# EasyEDA schematic SCH_openELECTRO - ArduinoUNO - OVEN_2022-06-18.json
TITLE: openELECTRO - ArduinoUNO SHIELD - oven; REV: 0.90; Date: 2022-06-16; Sheet: 1/1; Drawn By: carlymx; Company: carlymx@gmail.com
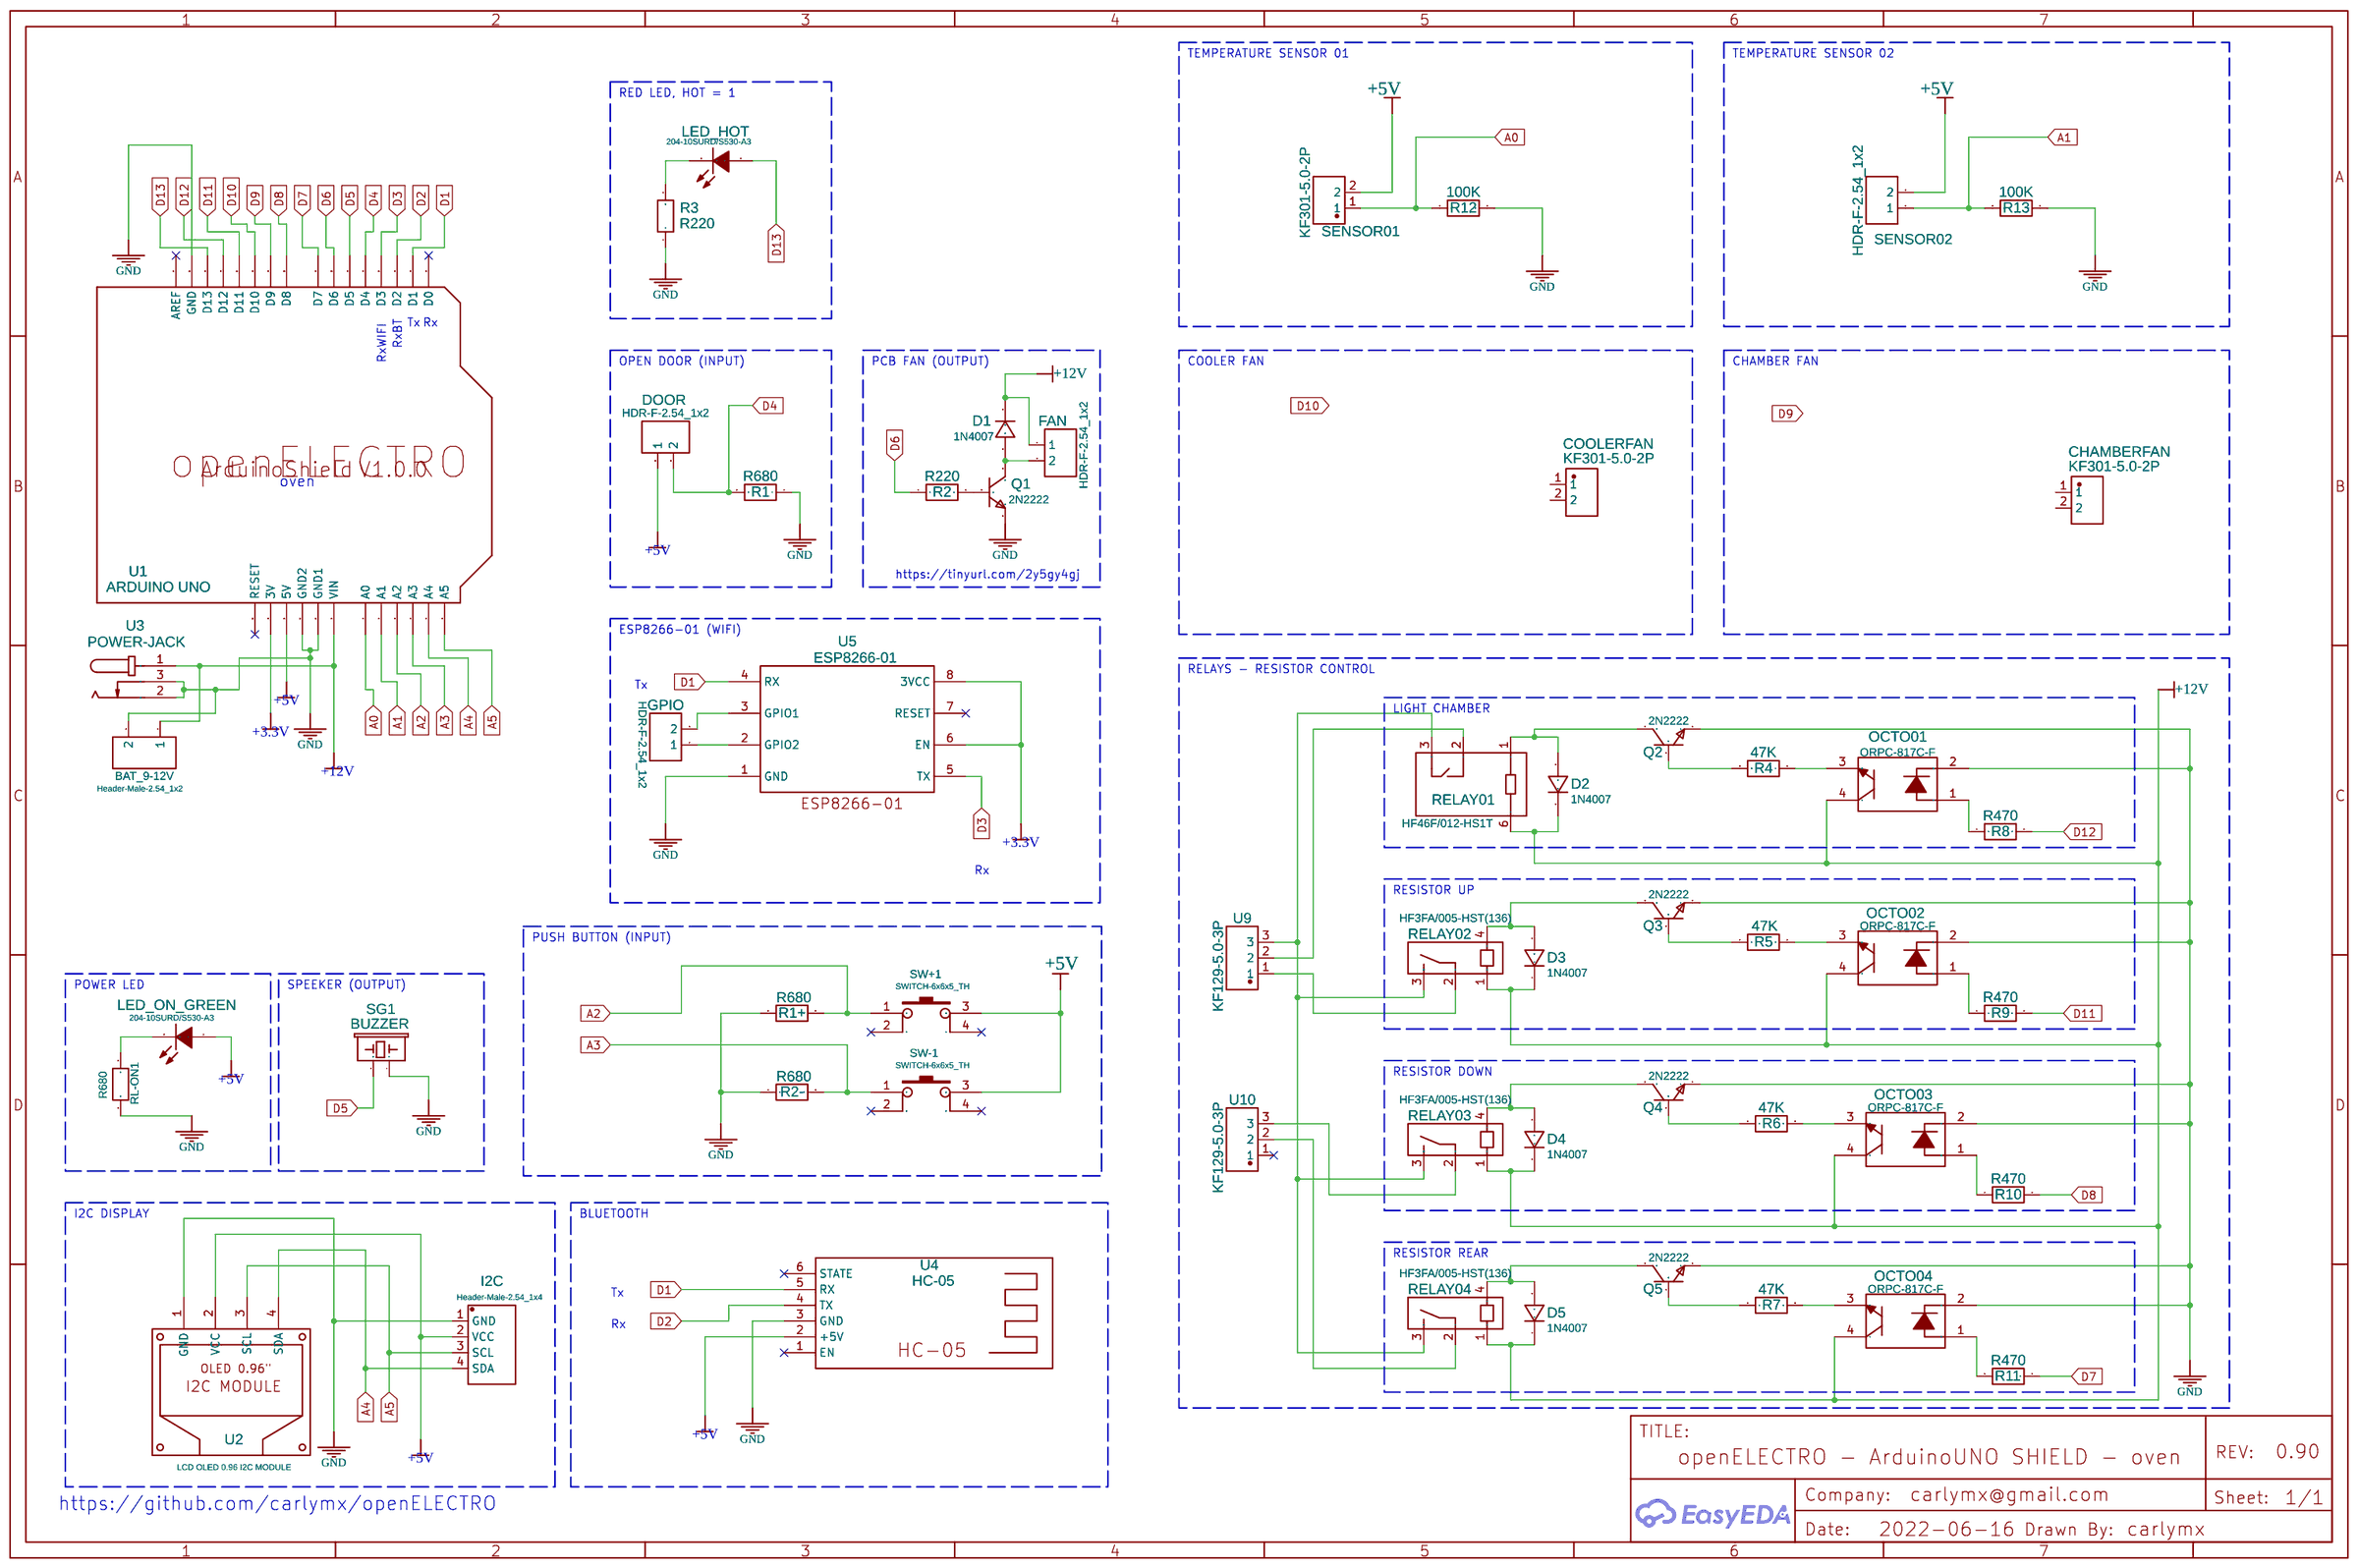
[diagram p0: schematic sheet]

## Parts
BAT_9-12V  Header-Male-2.54_1x2  [HDR-2X1/2.54]
CHAMBERFAN  KF301-5.0-2P  [CONN-TH_P5.00_KF301-5.0-2P]
COOLERFAN  KF301-5.0-2P  [CONN-TH_P5.00_KF301-5.0-2P]
D1  1N4007  [DO-41_BD2.4-L4.7-P8.70-D0.9-RD]
D2  1N4007  [DO-41_BD2.4-L4.7-P8.70-D0.9-RD]
D3  1N4007  [DO-41_BD2.4-L4.7-P8.70-D0.9-RD]
D4  1N4007  [DO-41_BD2.4-L4.7-P8.70-D0.9-RD]
D5  1N4007  [DO-41_BD2.4-L4.7-P8.70-D0.9-RD]
DOOR  HDR-F-2.54_1x2  [HDR-F-2.54_1X2]
FAN  HDR-F-2.54_1x2  [HDR-F-2.54_1X2]
GPIO  HDR-F-2.54_1x2  [HDR-F-2.54_1X2]
I2C  Header-Male-2.54_1x4  [DIP-1X4P-2.54MM-M]
LED_HOT  204-10SURD/S530-A3  [LED-3MM/2.54]
LED_ON_GREEN  204-10SURD/S530-A3  [LED-3MM/2.54]
OCTO01  ORPC-817C-F  [DIP-4_L4.6-W6.5-P2.54-LS7.6-BR]
OCTO02  ORPC-817C-F  [DIP-4_L4.6-W6.5-P2.54-LS7.6-BR]
OCTO03  ORPC-817C-F  [DIP-4_L4.6-W6.5-P2.54-LS7.6-BR]
OCTO04  ORPC-817C-F  [DIP-4_L4.6-W6.5-P2.54-LS7.6-BR]
Q1  2N2222  [TO-92-3_L4.9-W3.7-P1.27-L]
Q2  2N2222  [TO-92-3_L4.9-W3.7-P1.27-L]
Q3  2N2222  [TO-92-3_L4.9-W3.7-P1.27-L]
Q4  2N2222  [TO-92-3_L4.9-W3.7-P1.27-L]
Q5  2N2222  [TO-92-3_L4.9-W3.7-P1.27-L]
R1  R680  [R0603]
R1+  R680  [AXIAL-0.3]
R2  R220  [R0603]
R2-  R680  [AXIAL-0.3]
R3  R220  [R0603]
R4  47K  [R0603]
R5  47K  [R0603]
R6  47K  [R0603]
R7  47K  [R0603]
R8  R470  [R0603]
R9  R470  [R0603]
R10  R470  [R0603]
R11  R470  [R0603]
R12  100K  [R0603]
R13  100K  [R0603]
RELAY01  HF46F/012-HS1T  [RELAYS-TH_HF46F-XX-HS1-XXX]
RELAY02  HF3FA/005-HST(136)  [RELAY-TH_HF3FA-005-HST-136]
RELAY03  HF3FA/005-HST(136)  [RELAY-TH_HF3FA-005-HST-136]
RELAY04  HF3FA/005-HST(136)  [RELAY-TH_HF3FA-005-HST-136]
RL-ON1  R680  [AXIAL-0.3]
SENSOR01  KF301-5.0-2P  [CONN-TH_P5.00_KF301-5.0-2P]
SENSOR02  HDR-F-2.54_1x2  [HDR-F-2.54_1X2]
SG1  BUZZER  [BUZZER-12MM-NS-KIT]
SW+1  SWITCH-6x6x5_TH  [SWITCH-6X6X5_TH PAGE]
SW-1  SWITCH-6x6x5_TH  [SWITCH-6X6X5_TH PAGE]
U1  ARDUINO UNO  [SIMON.INO SHIELD]
U2  LCD OLED 0.96 I2C MODULE  [LCD OLED 0.96 I2C PCB MODULE]
U3  POWER-JACK  [DC-IN-TH_POWER-JACK]
U4  HC-05  [HC-05]
U5  ESP8266-01  [ESP8266-01]
U9  KF129-5.0-3P  [CONN-TH_3P-P5.00_KF129-5.0-3P]
U10  KF129-5.0-3P  [CONN-TH_3P-P5.00_KF129-5.0-3P]

## Library data of the parts
BAT_9-12V = -: Supplier: LCSC; Manufacturer: TE Connectivity; Manufacturer Part: 826629-2; image: //image.lceda.cn/szlcsc/C86471.jpg; Supplier Part: C86471
CHAMBERFAN COOLERFAN SENSOR01 = KF301-5.0-2P: Supplier: LCSC; Supplier Part: C474881; Manufacturer: Cixi Kefa Elec; Contributor: LCSC; JLCPCB Part Class: Extended Part
D1-D5 = 1N4007: Supplier: LCSC; Manufacturer: SEMTECH; Supplier Part: C106903; Contributor: LCEDA_Lib
DOOR FAN GPIO SENSOR02 = HDR-F-2.54_1x2: Supplier Part: C49661; Supplier: LCSC; Contributor: LCEDA_Lib
I2C = -: Supplier: LCSC; Manufacturer: Ckmtw; Manufacturer Part: 210S-1*4P L=11.6MMGold-plated black; Contributor: LCSC; Supplier Part: C124378
LED_HOT LED_ON_GREEN = -: Supplier: LCSC; Manufacturer: EVERLIGHT; Supplier Part: C99772
OCTO01 OCTO02 OCTO03 OCTO04 = ORPC-817C-F: Supplier: LCSC; Supplier Part: C2842770; Manufacturer: Orient(奥伦德); Contributor: LCSC
Q1-Q5 = 2N2222: Supplier: LCSC; Manufacturer: SEMTECH; Contributor: LCSC; Supplier Part: C118536; JLCPCB Part Class: Extended Part
R1-R13 = R_0603_EU: Contributor: LCEDA_Lib
R1+ R2- RL-ON1 = Res_AXIAL-0.3(1/8W)_EU
RELAY01 = HF46F/012-HS1T: Supplier: LCSC; Supplier Part: C2976852; Manufacturer: HF(宏发); link: https://atta.szlcsc.com/upload/public/pdf/source/20220224/4471DAC9234B5C2A1A34433FC9A7C12C.pdf; Contributor: LCSC
RELAY02 RELAY03 RELAY04 = HF3FA/005-HST(136): Supplier: LCSC; Supplier Part: C712707; Manufacturer: HF(Xiamen Hongfa Electroacoustic); Contributor: LCSC; JLCPCB Part Class: Extended Part
SG1 = -: Contributor: SparkFun
SW+1 SW-1 = -: Supplier Part: C69330; Supplier: LCSC; Manufacturer: LCSC
U1 = -: Arduino DiecimilaDuemilanove; Contributor: Adafruit
U2 = -: Manufacturer Part: Control Chip SSD1306; link: http://www.inno-maker.com/wp-content/uploads/2019/03/096-OLED-Module-User-Manual-v1000-en.pdf; Contributor: carlymx
U3 = POWER-JACK: Supplier: LCSC; Supplier Part: C9900001795; Manufacturer: null; JLCPCB Part Class: Extended Part; Contributor: LCSC
U4 = -: Supplier: MR; Contributor: SRY TIS
U5 = ESP8266-01: Supplier: LCSC; Contributor: Dan3D_Concept
U9 U10 = KF129-5.0-3P: Supplier: LCSC; Supplier Part: C475091; Manufacturer: Cixi Kefa Elec; Contributor: LCSC; JLCPCB Part Class: Extended Part

## Nets
+3.3V: U1.3V U5.6(EN) U5.8(3VCC)
+5V: DOOR.1 I2C.2(VCC) LED_ON_GREEN.1(A) SENSOR01.2 SENSOR02.2 SW+1.3 SW-1.3 U1.5V U2.2(VCC) U4.2(+5V)
+12V: BAT_9-12V.1 D1.1 D2.1 D3.1 D4.1 D5.1 FAN.1 OCTO01.4 OCTO02.4 OCTO03.4 OCTO04.4 RELAY01.6 RELAY02.1 RELAY03.1 RELAY04.1 U1.VIN U3.1
GND: BAT_9-12V.2 I2C.1(GND) OCTO01.2 OCTO02.2 OCTO03.2 OCTO04.2 Q1.1(E) Q2.1(E) Q3.1(E) Q4.1(E) Q5.1(E) R1.1 R1+.1 R2-.1 R3.1 R12.2 R13.2 RL-ON1.1 SG1.-(2) U1.GND U1.GND1 U1.GND2 U2.1(GND) U3.2 U3.3 U4.3(GND) U5.1(GND)
A0: R12.1 SENSOR01.1 U1.A0
A1: R13.1 SENSOR02.1 U1.A1
A2: R1+.2 SW+1.1 U1.A2
A3: R2-.2 SW-1.1 U1.A3
A4: I2C.4(SDA) U1.A4 U2.4(SDA)
A5: I2C.3(SCL) U1.A5 U2.3(SCL)
D1: U1.D1 U4.5(RX) U5.4(RX)
D2: U1.D2 U4.4(TX)
D3: U1.D3 U5.5(TX)
D4: DOOR.2 R1.2 U1.D4
D5: SG1.+(1) U1.D5
D6: R2.1 U1.D6
D7: R11.2 U1.D7
D8: R10.2 U1.D8
D9: U1.D9
D10: U1.D10
D11: R9.2 U1.D11
D12: R8.2 U1.D12
D13: LED_HOT.1(A) U1.D13
Net-(D1-2): D1.2 FAN.2 Q1.3(C)
Net-(D2-2): D2.2 Q2.3(C) RELAY01.1
Net-(D3-2): D3.2 Q3.3(C) RELAY02.4
Net-(D4-2): D4.2 Q4.3(C) RELAY03.4
Net-(D5-2): D5.2 Q5.3(C) RELAY04.4
Net-(GPIO-1): GPIO.1 U5.2(GPIO2)
Net-(GPIO-2): GPIO.2 U5.3(GPIO1)
Net-(LED_HOT-2): LED_HOT.2(K) R3.2
Net-(LED_ON_GREEN-2): LED_ON_GREEN.2(K) RL-ON1.2
Net-(OCTO01-1): OCTO01.1 R8.1
Net-(OCTO01-3): OCTO01.3 R4.1
Net-(OCTO02-1): OCTO02.1 R9.1
Net-(OCTO02-3): OCTO02.3 R5.2
Net-(OCTO03-1): OCTO03.1 R10.1
Net-(OCTO03-3): OCTO03.3 R6.2
Net-(OCTO04-1): OCTO04.1 R11.1
Net-(OCTO04-3): OCTO04.3 R7.2
Net-(Q1-2): Q1.2(B) R2.2
Net-(Q2-2): Q2.2(B) R4.2
Net-(Q3-2): Q3.2(B) R5.1
Net-(Q4-2): Q4.2(B) R6.1
Net-(Q5-2): Q5.2(B) R7.1
Net-(RELAY01-2): RELAY01.2 U9.2
Net-(RELAY01-3): RELAY01.3 RELAY02.3 RELAY03.3 RELAY04.3 U9.3
Net-(RELAY02-2): RELAY02.2 U9.1
Net-(RELAY03-2): RELAY03.2 U10.3
Net-(RELAY04-2): RELAY04.2 U10.2

Not connected (* = marked no-connect by the designer): CHAMBERFAN 1 2; COOLERFAN 1 2; SW+1 2* 4*; SW-1 2* 4*; U1 AREF* D0* RESET*; U4 1(EN)* 6(STATE)*; U5 7(RESET)*; U10 1*

## Notes on the sheet
- TEMPERATURE SENSOR 01
- TEMPERATURE SENSOR 02
- RED LED, HOT = 1
- Tx
- Rx
- RxBT
- RxWIFI
- OPEN DOOR (INPUT)
- PCB FAN (OUTPUT)
- COOLER FAN
- CHAMBER FAN
- oven
- https://tinyurl.com/2y5gy4gj
- ESP8266-01 (WIFI)
- RELAYS - RESISTOR CONTROL
- Tx
- LIGHT CHAMBER
- Rx
- RESISTOR UP
- PUSH BUTTON (INPUT)
- POWER LED
- SPEEKER (OUTPUT)
- RESISTOR DOWN
- I2C DISPLAY
- BLUETOOTH
- RESISTOR REAR
- Tx
- Rx
- https://github.com/carlymx/openELECTRO
